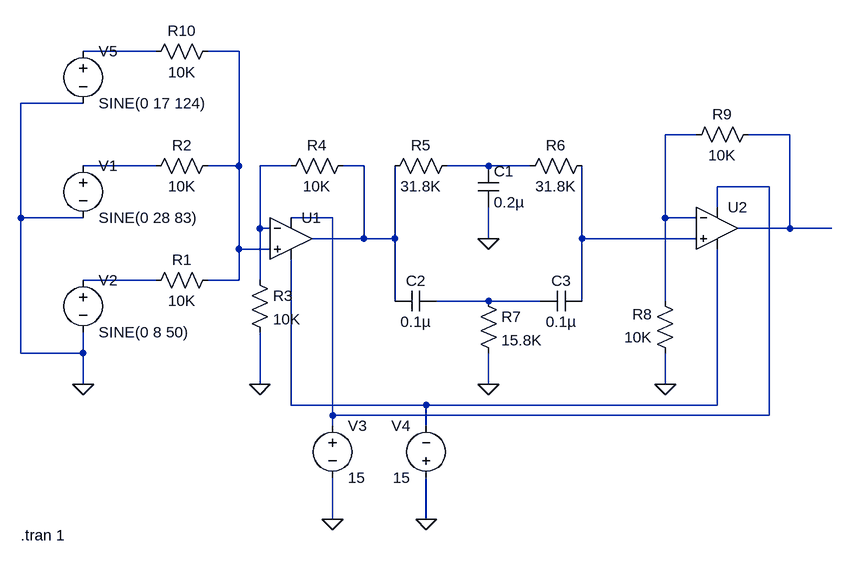
[diagram p0: schematic 50HzAttenuator.asc]
50HzAttenuator.asc, the LTspice schematic file:
Version 4.1
SHEET 1 1412 680
WIRE 144 -96 32 -96
WIRE 272 -96 224 -96
WIRE 32 -16 -64 -16
WIRE 976 32 928 32
WIRE 1120 32 1056 32
WIRE 144 80 32 80
WIRE 272 80 272 -96
WIRE 272 80 224 80
WIRE 352 80 304 80
WIRE 464 80 432 80
WIRE 656 80 592 80
WIRE 720 80 656 80
WIRE 1088 112 1008 112
WIRE 1008 144 1008 112
WIRE -64 160 -64 -16
WIRE 32 160 -64 160
WIRE 416 160 352 160
WIRE 928 160 928 32
WIRE 976 160 928 160
WIRE 304 176 304 80
WIRE 320 176 304 176
WIRE 1120 176 1120 32
WIRE 1120 176 1040 176
WIRE 1184 176 1120 176
WIRE 464 192 464 80
WIRE 464 192 384 192
WIRE 512 192 512 80
WIRE 512 192 464 192
WIRE 656 192 656 144
WIRE 800 192 800 80
WIRE 976 192 800 192
WIRE 272 208 272 80
WIRE 320 208 272 208
WIRE 144 256 32 256
WIRE 272 256 272 208
WIRE 272 256 224 256
WIRE 304 256 304 176
WIRE 512 288 512 192
WIRE 656 288 576 288
WIRE 736 288 656 288
WIRE 800 288 800 192
WIRE 928 288 928 160
WIRE -64 368 -64 160
WIRE 32 368 32 336
WIRE 32 368 -64 368
WIRE 32 416 32 368
WIRE 304 416 304 336
WIRE 656 416 656 368
WIRE 928 416 928 368
WIRE 352 448 352 224
WIRE 560 448 352 448
WIRE 1008 448 1008 208
WIRE 1008 448 560 448
WIRE 416 464 416 160
WIRE 1088 464 1088 112
WIRE 1088 464 416 464
WIRE 416 480 416 464
WIRE 560 480 560 448
WIRE 416 624 416 560
WIRE 560 624 560 560
FLAG 32 416 0
FLAG 416 624 0
FLAG 560 624 0
FLAG 656 192 0
FLAG 656 416 0
FLAG 304 416 0
FLAG 928 416 0
SYMBOL voltage 32 64 R0
WINDOW 123 0 0 Left 0
WINDOW 39 0 0 Left 0
SYMATTR InstName V1
SYMATTR Value SINE(0 28 83)
SYMBOL voltage 32 240 R0
WINDOW 123 0 0 Left 0
WINDOW 39 0 0 Left 0
SYMATTR InstName V2
SYMATTR Value SINE(0 8 50)
SYMBOL OpAmps\\UniversalOpAmp 352 192 R0
SYMATTR InstName U1
SYMBOL res 240 240 R90
WINDOW 0 0 56 VBottom 2
WINDOW 3 32 56 VTop 2
SYMATTR InstName R1
SYMATTR Value 10K
SYMATTR SpiceLine tol=1 pwr=0.1
SYMBOL res 240 64 R90
WINDOW 0 0 56 VBottom 2
WINDOW 3 32 56 VTop 2
SYMATTR InstName R2
SYMATTR Value 10K
SYMATTR SpiceLine tol=1 pwr=0.1
SYMBOL res 288 240 R0
SYMATTR InstName R3
SYMATTR Value 10K
SYMATTR SpiceLine tol=1 pwr=0.1
SYMBOL res 448 64 R90
WINDOW 0 0 56 VBottom 2
WINDOW 3 32 56 VTop 2
SYMATTR InstName R4
SYMATTR Value 10K
SYMATTR SpiceLine tol=1 pwr=0.1
SYMBOL voltage 416 464 R0
WINDOW 123 0 0 Left 0
WINDOW 39 0 0 Left 0
SYMATTR InstName V3
SYMATTR Value 15
SYMBOL voltage 560 576 R180
WINDOW 0 24 96 Left 2
WINDOW 3 24 16 Left 2
WINDOW 123 0 0 Left 0
WINDOW 39 0 0 Left 0
SYMATTR InstName V4
SYMATTR Value 15
SYMBOL res 608 64 R90
WINDOW 0 0 56 VBottom 2
WINDOW 3 32 56 VTop 2
SYMATTR InstName R5
SYMATTR Value 31.8K
SYMATTR SpiceLine tol=1 pwr=0.1
SYMBOL res 816 64 R90
WINDOW 0 0 56 VBottom 2
WINDOW 3 32 56 VTop 2
SYMATTR InstName R6
SYMATTR Value 31.8K
SYMATTR SpiceLine tol=1 pwr=0.1
SYMBOL cap 640 80 R0
SYMATTR InstName C1
SYMATTR Value 0.2µ
SYMATTR SpiceLine V=4 Irms=2.91 Rser=0.0415177 Lser=0
SYMBOL res 640 272 R0
SYMATTR InstName R7
SYMATTR Value 15.8K
SYMATTR SpiceLine tol=1 pwr=0.1
SYMBOL cap 576 272 R90
WINDOW 0 0 32 VBottom 2
WINDOW 3 32 32 VTop 2
SYMATTR InstName C2
SYMATTR Value 0.1µ
SYMATTR SpiceLine V=4 Irms=0 Rser=0 Lser=0 mfg="Murata" pn="GRM022R60G153KE15" type="X5R"
SYMBOL cap 800 272 R90
WINDOW 0 0 32 VBottom 2
WINDOW 3 32 32 VTop 2
SYMATTR InstName C3
SYMATTR Value 0.1µ
SYMATTR SpiceLine V=4 Irms=0 Rser=0 Lser=0 mfg="Murata" pn="GRM022R60G153KE15" type="X5R"
SYMBOL OpAmps\\UniversalOpAmp 1008 176 R0
SYMATTR InstName U2
SYMBOL res 944 384 R180
WINDOW 0 36 76 Left 2
WINDOW 3 36 40 Left 2
SYMATTR InstName R8
SYMATTR Value 10K
SYMATTR SpiceLine tol=1 pwr=0.1
SYMBOL res 1072 16 R90
WINDOW 0 0 56 VBottom 2
WINDOW 3 32 56 VTop 2
SYMATTR InstName R9
SYMATTR Value 10K
SYMATTR SpiceLine tol=1 pwr=0.1
SYMBOL voltage 32 -112 R0
WINDOW 123 0 0 Left 0
WINDOW 39 0 0 Left 0
SYMATTR InstName V5
SYMATTR Value SINE(0 17 124)
SYMBOL res 240 -112 R90
WINDOW 0 0 56 VBottom 2
WINDOW 3 32 56 VTop 2
SYMATTR InstName R10
SYMATTR Value 10K
SYMATTR SpiceLine tol=1 pwr=0.1
TEXT -64 648 Left 2 !.tran 1

The netlist it stands for:
* 50HzAttenuator.asc
V1 N005 0 SINE(0 28 83)
V2 N011 0 SINE(0 8 50)
X§U1 N002 N006 N009 N013 N007 level1 Avol=1Meg GBW=10Meg Vos=0 En=0 Enk=0 In=0 Ink=0 Rin=500Meg  ; pins In+ In- V+ V- OUT
R1 N002 N011 10K tol=1 pwr=0.1
R2 N002 N005 10K tol=1 pwr=0.1
R3 N006 0 10K tol=1 pwr=0.1
R4 N007 N006 10K tol=1 pwr=0.1
V3 N009 0 15
V4 0 N013 15
R5 N008 N007 31.8K tol=1 pwr=0.1
R6 N010 N008 31.8K tol=1 pwr=0.1
C1 N008 0 0.2µ V=4 Irms=2.91 Rser=0.0415177 Lser=0
R7 N012 0 15.8K tol=1 pwr=0.1
C2 N012 N007 0.1µ V=4 Irms=0 Rser=0 Lser=0 mfg="Murata" pn="GRM022R60G153KE15" type="X5R"
C3 N010 N012 0.1µ V=4 Irms=0 Rser=0 Lser=0 mfg="Murata" pn="GRM022R60G153KE15" type="X5R"
X§U2 N010 N003 N009 N013 N004 level1 Avol=1Meg GBW=10Meg Vos=0 En=0 Enk=0 In=0 Ink=0 Rin=500Meg  ; pins In+ In- V+ V- OUT
R8 0 N003 10K tol=1 pwr=0.1
R9 N004 N003 10K tol=1 pwr=0.1
V5 N001 0 SINE(0 17 124)
R10 N002 N001 10K tol=1 pwr=0.1
.tran 1
.lib UniversalOpAmp1.lib
.backanno
.end